# Altium schematic sheet tach key H-4key.SchDoc
size A3
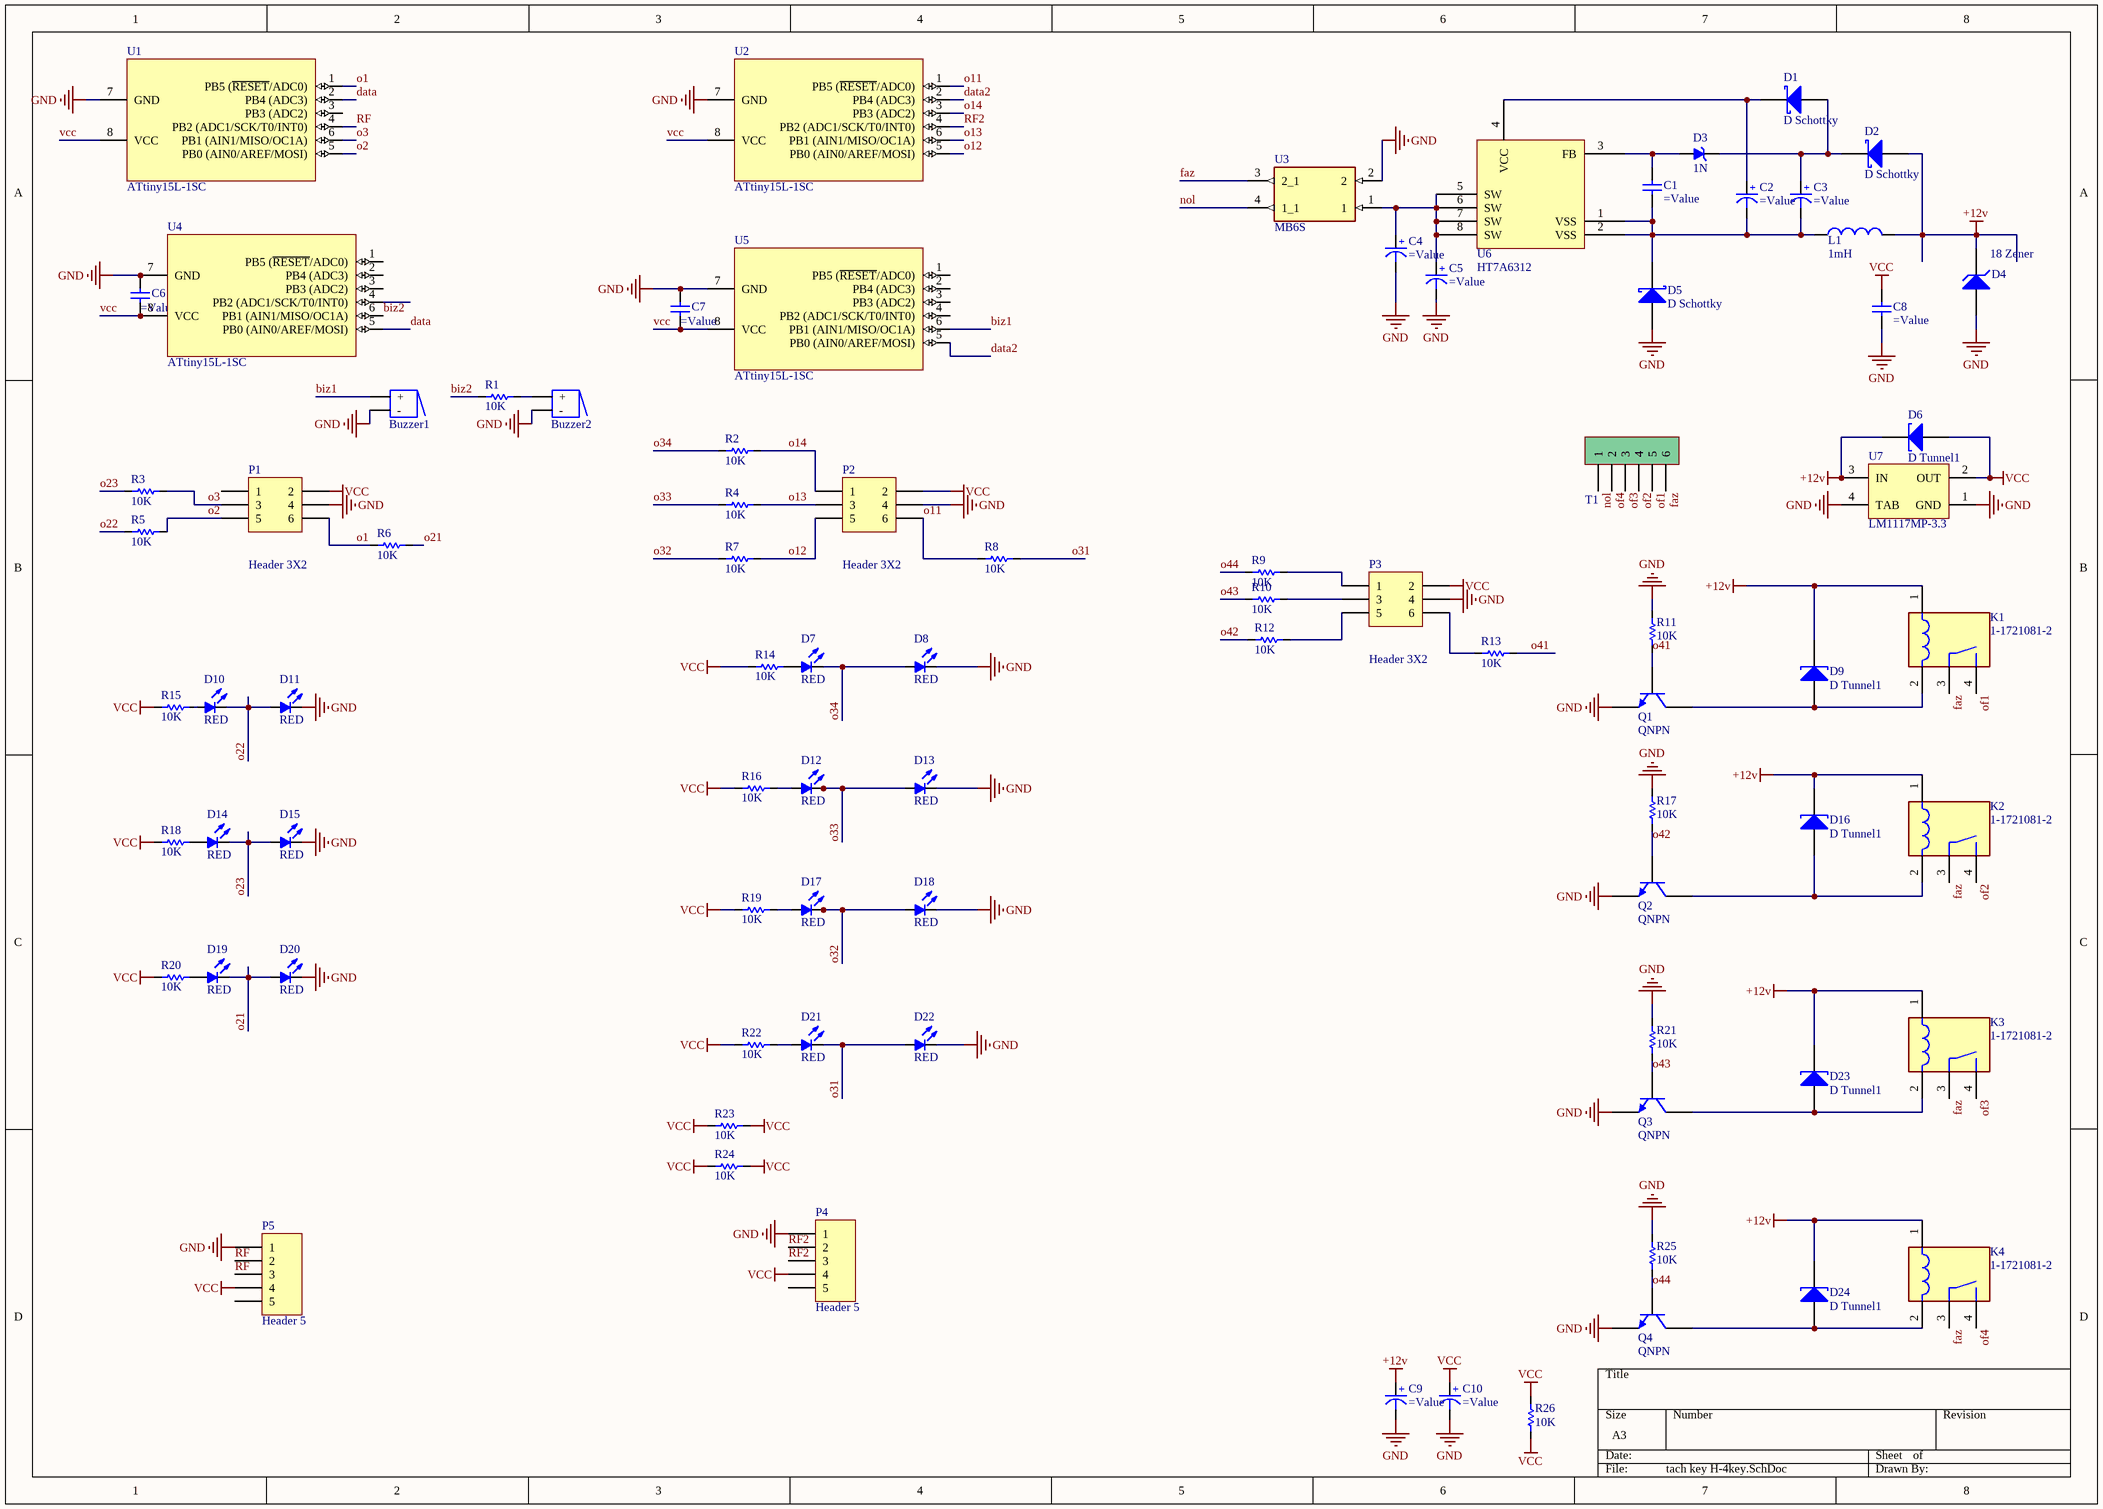
[diagram p0: tach key H-4key.SchDoc]

## Parts
Buzzer1  Buzzer  [BUZZER]  (value not drawn)
Buzzer2  Buzzer  [BUZZER]  (value not drawn)
C1  (no value)  [CAP 1206]
C2  (no value)  [ELEC-CAP-RAD10-20]
C3  (no value)  [ELEC-CAP-RAD10-20]
C4  (no value)  [ELEC-CAP-RAD15-30]
C5  (no value)  [ELEC-CAP-RAD15-30]
C6  (no value)  [CAP 1206]
C7  (no value)  [CAP 1206]
C8  (no value)  [CAP 1206]
C9  (no value)  [ELEC-CAP-RAD15-30]
C10  (no value)  [ELEC-CAP-RAD15-30]
D1  D Schottky  [SMB]
D2  D Schottky  [SMB]
D3  MODEL: 1N  [DO-35]  (hidden comment: Zener Diode)
D4  18 Zener  [minimelf]
D5  D Schottky  [SMB]
D6  D Tunnel1  [3.2X1.6X1.1]
D7  COLOR: RED  [RES 0805 (2012X06L)]  (hidden comment: MODEL)
D8  COLOR: RED  [RES 0805 (2012X06L)]  (hidden comment: MODEL)
D9  D Tunnel1  [3.2X1.6X1.1]
D10  COLOR: RED  [RES 0805 (2012X06L)]  (hidden comment: MODEL)
D11  COLOR: RED  [RES 0805 (2012X06L)]  (hidden comment: MODEL)
D12  COLOR: RED  [RES 0805 (2012X06L)]  (hidden comment: MODEL)
D13  COLOR: RED  [RES 0805 (2012X06L)]  (hidden comment: MODEL)
D14  COLOR: RED  [RES 0805 (2012X06L)]  (hidden comment: MODEL)
D15  COLOR: RED  [RES 0805 (2012X06L)]  (hidden comment: MODEL)
D16  D Tunnel1  [3.2X1.6X1.1]
D17  COLOR: RED  [RES 0805 (2012X06L)]  (hidden comment: MODEL)
D18  COLOR: RED  [RES 0805 (2012X06L)]  (hidden comment: MODEL)
D19  COLOR: RED  [RES 0805 (2012X06L)]  (hidden comment: MODEL)
D20  COLOR: RED  [RES 0805 (2012X06L)]  (hidden comment: MODEL)
D21  COLOR: RED  [RES 0805 (2012X06L)]  (hidden comment: MODEL)
D22  COLOR: RED  [RES 0805 (2012X06L)]  (hidden comment: MODEL)
D23  D Tunnel1  [3.2X1.6X1.1]
D24  D Tunnel1  [3.2X1.6X1.1]
K1  1-1721081-2  [TE_1-1721081-2]
K2  1-1721081-2  [TE_1-1721081-2]
K3  1-1721081-2  [TE_1-1721081-2]
K4  1-1721081-2  [TE_1-1721081-2]
L1  1mH  [HS1101]
P1  Header 3X2  [HDR2X3]
P2  Header 3X2  [HDR2X3]
P3  Header 3X2  [HDR2X3]
P4  Header 5  [HDR1X5]
P5  Header 5  [HDR1X5]
Q1  QNPN  [SOT-23B_L]
Q2  QNPN  [SOT-23B_L]
Q3  QNPN  [SOT-23B_L]
Q4  QNPN  [SOT-23B_L]
R1  10K  [RES 1206 (3216X08L)]
R2  10K  [RES 1206 (3216X08L)]
R3  10K  [RES 1206 (3216X08L)]
R4  10K  [Res-(1/4)]
R5  10K  [RES 1206 (3216X08L)]
R6  10K  [RES 1206 (3216X08L)]
R7  10K  [Res-(1/4)]
R8  10K  [RES 1206 (3216X08L)]
R9  10K  [RES 1206 (3216X08L)]
R10  10K  [RES 1206 (3216X08L)]
R11  10K  [RES 1206 (3216X08L)]
R12  10K  [RES 1206 (3216X08L)]
R13  10K  [RES 1206 (3216X08L)]
R14  10K  [RES 1206 (3216X08L)]
R15  10K  [RES 1206 (3216X08L)]
R16  10K  [RES 1206 (3216X08L)]
R17  10K  [RES 1206 (3216X08L)]
R18  10K  [RES 1206 (3216X08L)]
R19  10K  [RES 1206 (3216X08L)]
R20  10K  [RES 1206 (3216X08L)]
R21  10K  [RES 1206 (3216X08L)]
R22  10K  [RES 1206 (3216X08L)]
R23  10K  [RES 1206 (3216X08L)]
R24  10K  [RES 1206 (3216X08L)]
R25  10K  [RES 1206 (3216X08L)]
R26  10K  [RES 1206 (3216X08L)]
T1  Phoenix terminal  [phoenix terminal 6]  (value not drawn)
U1  ATtiny15L-1SC  [8S2_N]
U2  ATtiny15L-1SC  [8S2_N]
U3  MB6S  [SOIC245P670X270-4N]
U4  ATtiny15L-1SC  [8S2_N]
U5  ATtiny15L-1SC  [8S2_N]
U6  HT7A6312  [SOIC127P599X175-8N]
U7  LM1117MP-3.3  [SOT89L]

## Nets
+12v: C9.2(+) D2.1(A) D4.2(K) D6.2(K) D9.2(K) D16.2(K) D23.2(K) D24.2(K) K1.1 K2.1 K3.1 K4.1 L1.2 U7.3(IN)
GND: Buzzer1.2(-) Buzzer2.2(-) C4.1(-) C5.1(-) C6.1(+) C7.1(+) C8.2(-) C9.1(-) C10.1(-) D4.1(A) D5.1(A) D8.2(K) D11.2(K) D13.2(K) D15.2(K) D18.2(K) D20.2(K) D22.2(K) P1.4 P2.4 P3.4 P4.1 P5.1 Q1.3(E) Q2.3(E) Q3.3(E) Q4.3(E) R11.2 R17.2 R21.2 R25.2 U1.7(GND) U2.7(GND) U3.2 U4.7(GND) U5.7(GND) U7.1(GND) U7.4(TAB)
vcc: C6.2(-) C7.2(-) C8.1(+) C10.2(+) D6.1(A) P1.2 P2.2 P3.2 P4.4 P5.4 R14.2 R15.2 R16.2 R18.2 R19.2 R20.2 R22.2 R23.1 R23.2 R24.1 R24.2 R26.1 R26.2 U1.8(VCC) U2.8(VCC) U4.8(VCC) U5.8(VCC) U7.2(OUT)
biz1: Buzzer1.1(+) U5.6(PB1_(AIN1/MISO/OC1A))
biz2: R1.2 U4.6(PB1_(AIN1/MISO/OC1A))
data: U1.2(PB4_(ADC3)) U4.5(PB0_(AIN0/AREF/MOSI))
data2: U2.2(PB4_(ADC3)) U5.5(PB0_(AIN0/AREF/MOSI))
faz: K1.3 K2.3 K3.3 K4.3 T1.6 U3.3(2_1)
nol: T1.1 U3.4(1_1)
o1: P1.6 R6.2 U1.1(PB5_(~{RESET}/ADC0))
o2: P1.5 R5.2 U1.5(PB0_(AIN0/AREF/MOSI))
o3: P1.3 R3.2 U1.6(PB1_(AIN1/MISO/OC1A))
o11: P2.6 R8.2 U2.1(PB5_(~{RESET}/ADC0))
o12: P2.5 R7.2 U2.5(PB0_(AIN0/AREF/MOSI))
o13: P2.3 R4.2 U2.6(PB1_(AIN1/MISO/OC1A))
o14: P2.1 R2.2 U2.3(PB3_(ADC2))
o21: D19.2(K) D20.1(A) R6.1
o22: D10.2(K) D11.1(A) R5.1
o23: D14.2(K) D15.1(A) R3.1
o31: D21.2(K) D22.1(A) R8.1
o32: D17.2(K) D18.1(A) R7.1
o33: D12.2(K) D13.1(A) R4.1
o34: D7.2(K) D8.1(A) R2.1
o41: Q1.2(B) R11.1 R13.1
o42: Q2.2(B) R12.1 R17.1
o43: Q3.2(B) R10.1 R21.1
o44: Q4.2(B) R9.1 R25.1
of1: K1.4 T1.5
of2: K2.4 T1.4
of3: K3.4 T1.3
of4: K4.4 T1.2
RF: P5.2 P5.3 U1.4(PB2_(ADC1/SCK/T0/INT0))
RF2: P4.2 P4.3 U2.4(PB2_(ADC1/SCK/T0/INT0))
NetBuzzer2_1: Buzzer2.1(+) R1.1
NetC1_1: C1.1(+) D3.1(A) U6.3(FB)
NetC1_2: C1.2(-) C2.1(-) C3.1(-) D5.2(K) L1.1 U6.1(VSS) U6.2(VSS)
NetC2_2: C2.2(+) D1.2(K) U6.4(VCC)
NetC3_2: C3.2(+) D1.1(A) D2.2(K) D3.2(K)
NetC4_2: C4.2(+) C5.2(+) U3.1 U6.5(SW) U6.6(SW) U6.7(SW) U6.8(SW)
NetD7_1: D7.1(A) R14.1
NetD9_1: D9.1(A) K1.2 Q1.1(C)
NetD10_1: D10.1(A) R15.1
NetD12_1: D12.1(A) R16.1
NetD14_1: D14.1(A) R18.1
NetD16_1: D16.1(A) K2.2 Q2.1(C)
NetD17_1: D17.1(A) R19.1
NetD19_1: D19.1(A) R20.1
NetD21_1: D21.1(A) R22.1
NetD23_1: D23.1(A) K3.2 Q3.1(C)
NetD24_1: D24.1(A) K4.2 Q4.1(C)
NetP3_1: P3.1 R9.2
NetP3_3: P3.3 R10.2
NetP3_5: P3.5 R12.2
NetP3_6: P3.6 R13.2

Not connected (* = marked no-connect by the designer): P1 1; P4 5; P5 5; U1 3(PB3_(ADC2)); U4 1(PB5_(~{RESET}/ADC0)) 2(PB4_(ADC3)) 3(PB3_(ADC2)) 4(PB2_(ADC1/SCK/T0/INT0)); U5 1(PB5_(~{RESET}/ADC0)) 2(PB4_(ADC3)) 3(PB3_(ADC2)) 4(PB2_(ADC1/SCK/T0/INT0))

## Library data of the parts
Buzzer1 Buzzer2 = Buzzer: Designer: Seyed Mohsen Ghasemain; ComponentLinkURL: www.picpars.com
C1 C6-C8 = Capacitor
C2-C5 C9 C10 = Capacitor Electrolytic: Electrolytic Capacitor
D1 D2 D5 = D Schottky: Schottky Diode; Published: 8-Jun-2000; LatestRevisionDate: 17-Jul-2002; LatestRevisionNote: Re-released for DXP Platform.; PackageReference: SMB; Publisher: Altium Limited; PackageDescription: DO-214-AA/SMB; 2 C-Bend Leads; Body 5.3 x 3.6 mm, inc. leads (LxW); Code_JEDEC: DO-214-AA
D4 = D Zener: Zener Diode; Published: 8-Jun-2000; LatestRevisionDate: 17-Jul-2002; LatestRevisionNote: Re-released for DXP Platform.; PackageReference: DIODE-0.7; Publisher: Altium Limited
D6 D9 D16 D23 D24 = D Tunnel1: Tunnel Diode - RLC Model; Published: 8-Jun-2000; LatestRevisionDate: 17-Jul-2002; LatestRevisionNote: Re-released for DXP Platform.; PackageVersion: Feb-2002; PackageReference: 3.2X1.6X1.1; Publisher: Altium Limited; PackageDescription: SM LED; 2 Flat Leads
D7 D8 D10-D15 D17-D22 = LED 5mm: Typical LED
K1-K4 = 1-1721081-2: General Purpose Relay SPST-NO (1 Form A) 12VDC Coil Through Hole; MF: TE Connectivity; SnapEDA_Link: https://www.snapeda.com/parts/1-1721081-2/TE+Connectivity+Potter+%2526+Brumfield+Relays/view-part/?ref=snap; Package: None; Value: *; MP: 1-1721081-2; Check_prices: https://www.snapeda.com/parts/1-1721081-2/TE+Connectivity+Potter+%2526+Brumfield+Relays/view-part/?ref=eda
L1 = Inductor: Code_IEC: 1005; Published: 8-Jun-2000; LatestRevisionDate: 17-Jul-2002; LatestRevisionNote: Re-released for DXP Platform.; PackageReference: 0402-A; Publisher: Altium Limited; Code_JEITA: 0402; Value: 1mH
P1-P3 = Header 3X2: Header, 3-Pin, Dual row; LatestRevisionDate: 17-Jul-2002; LatestRevisionNote: Re-released for DXP Platform.; Publisher: Altium Limited
P4 P5 = Header 5: Header, 5-Pin; LatestRevisionDate: 17-Jul-2002; LatestRevisionNote: Re-released for DXP Platform.; Publisher: Altium Limited
Q1-Q4 = QNPN: NPN Bipolar Transistor; pin to pad: 1>3 2>1 3>2; Published: 8-Jun-2000; LatestRevisionDate: 29-May-2009; LatestRevisionNote: IPC-7351 Footprint Added.; PackageVersion: Aug-1999; PackageReference: SOT-23B; Publisher: Altium Limited; PackageDescription: 3-Pin SOT-23 Package 0.95 mm Pitch, 2.4 mm Lead Span
R1-R26 = Resistor: Tolerance: 5%; Power: 1/4 W; Value: 10K
T1 = Phoenix terminal 6: Terminal 6 Pin; Designer: Seyed Mohsen Ghasemain; E-mail: picpars@gmail.com; ComponentLinkURL: www.picpars.com
U1 U2 = ATtiny15L-1SC: 8-Bit AVR Microcontroller with 1K Byte of Flash Memory; pin to pad: 1>7 7>8 8>1; Published: 17-Sep-2003; LatestRevisionDate: 16-Oct-2006; LatestRevisionNote: IPC-7351 Footprint Added.; DatasheetVersion: 1187E-AVR-06/02; PackageVersion: revF, Apr-2008; PackageReference: 8S2; Publisher: Altium Limited; PackageDescription: 8-Lead, 0.208" Body, Plastic Small Outline Package (EIAJ); Supplier 1: Digi-Key; Supplier Part Number 1: ATTINY15L-1SC-ND; Supplier 2: Mouser; Supplier Part Number 2: 556-ATTINY15L1SC; ComponentLink1Description: Datasheet; ComponentLink1URL: http://www.atmel.com/dyn/resources/prod_documents/doc1187.pdf; ComponentLink2Description: Atmel.com Home; ComponentLink2URL: http://www.atmel.com
U3 = MB6S: Bridge Rectifier Single Phase Standard 600V Surface Mount 4-SOIC; MF: ON Semiconductor; Digi-Key_Purchase_URL: https://www.digikey.com.tr/product-detail/en/on-semiconductor/MB6S/MB6SCT-ND/965654?utm_source=snapeda&utm_medium=aggregator&utm_campaign=symbol; Value: *; Package: BESOP-4 Surge Components; Digi-Key_Part_Number: MB6SCT-ND; SnapEDA_Link: https://www.snapeda.com/parts/MB6S/ON%20Semiconductor/view-part/2774209/?ref=snap; MP: MB6S
U4 U5 = ATtiny15L-1SC: 8-Bit AVR Microcontroller with 1K Byte of Flash Memory; pin to pad: 1>5 2>6 3>7 4>8 5>1 6>2 7>3 8>4; Published: 17-Sep-2003; LatestRevisionDate: 16-Oct-2006; LatestRevisionNote: IPC-7351 Footprint Added.; DatasheetVersion: 1187E-AVR-06/02; PackageVersion: revF, Apr-2008; PackageReference: 8S2; Publisher: Altium Limited; PackageDescription: 8-Lead, 0.208" Body, Plastic Small Outline Package (EIAJ); Supplier 1: Digi-Key; Supplier Part Number 1: ATTINY15L-1SC-ND; Supplier 2: Mouser; Supplier Part Number 2: 556-ATTINY15L1SC; ComponentLink1Description: Datasheet; ComponentLink1URL: http://www.atmel.com/dyn/resources/prod_documents/doc1187.pdf; ComponentLink2Description: Atmel.com Home; ComponentLink2URL: http://www.atmel.com
U6 = Component_1
U7 = LM1117MP-3.3: 800mA Low-Dropout Linear Regulator; pin to pad: 1>2 2>1; Manufacturer: National Semiconductor; CompType: LDO IC; PackageTopMarking: XYTT*N05A; PowerWise: N; Published: 4-Dec-2008; DatasheetVersion: Apr-2006; PackageVersion: revB, Apr-2003; PackageReference: MP04A; Publisher: Altium Limited; PackageDescription: Molded SOT-223, 6.50 x 3.56 x 1.6mm Body, 4 Lead, 2.3mm Pitch; PartNumber: LM1117MP-3.3; RoHS: O; PinCount: 4; DigiKeyPartNumber: LM1117MP-3.3CT-ND; Code_JEDEC: TO-261-AA; Code_IPC: SOT223-4; ComponentLink1Description: LM1117 Datasheet; ComponentLink1URL: http://www.national.com/ds/LM/LM1117.pdf; ComponentLink2Description: LM1117 Web Page; ComponentLink2URL: http://www.national.com/pf/LM/LM1117.html; ComponentLink3Description: MP04A Package Page; ComponentLink3URL: http://www.national.com/packaging/folders/mp04a.html